# EAGLE design Bitcrusher (EAGLE 8.5.2)
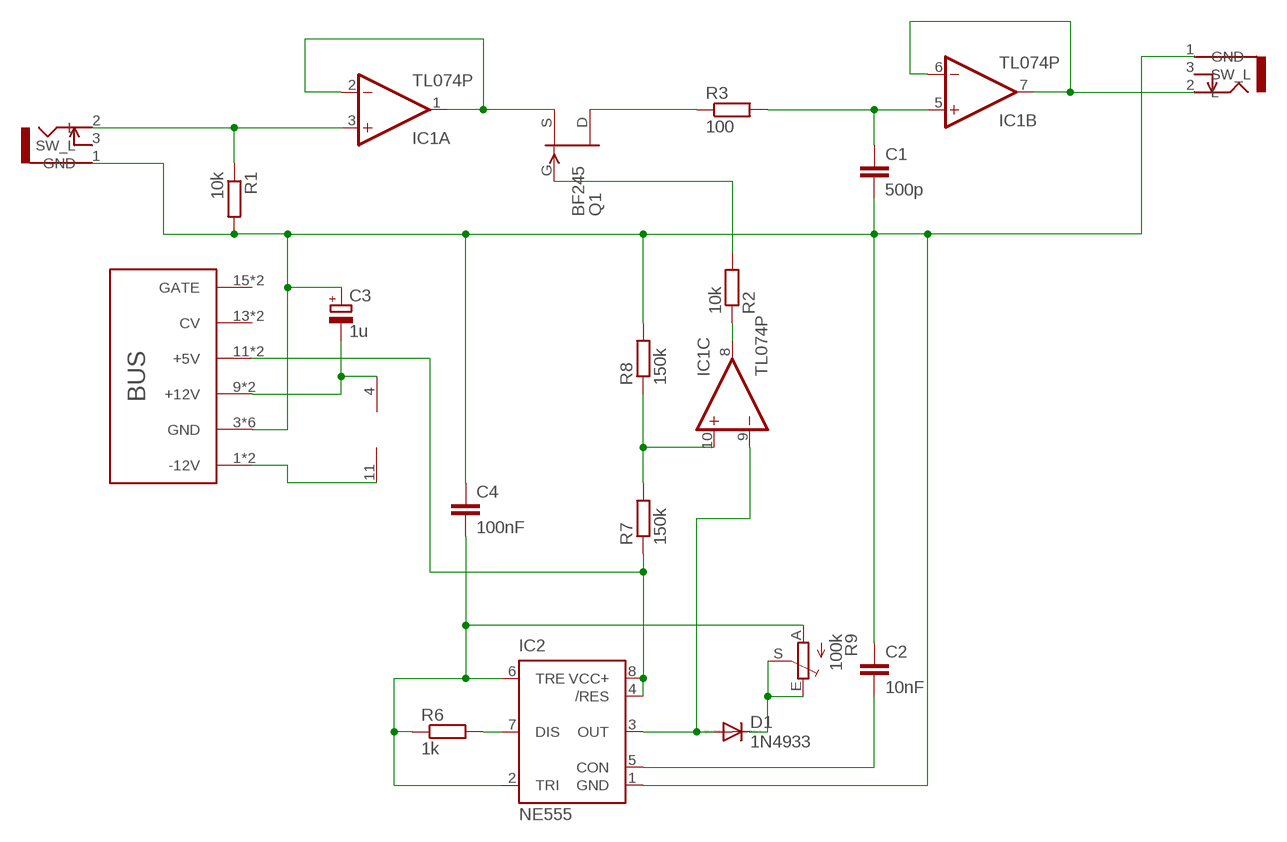
[diagram p0: schematic, sheet 1]

## Parts
C1  500p  C-EU050-024X044  [C050-024X044]
C2  10nF  C-EU050-024X044  [C050-024X044]
C3  1u  CPOL-EUE5-4  [E5-4]
C4  100nF  C-EU050-024X044  [C050-024X044]
D1  1N4933  [DO41-10]
IC1  TL074P  [DIL14]
IC2  NE555  [DIL-08]
Q1  BF245  [TO92]
R1  10k  R-EU_0309/12  [0309/12]
R2  10k  R-EU_0309/12  [0309/12]
R3  100  R-EU_0309/12  [0309/12]
R6  1k  R-EU_0309/12  [0309/12]
R7  150k  R-EU_0309/12  [0309/12]
R8  150k  R-EU_0309/12  [0309/12]
R9  100k  TRIM_EU-CIP20C-6MM  [CIP20C-6MM]
SOUND_INPUT  JC-128-MONO  [JC128]
SOUND_OUTPUT  JC-128-MONO  [JC128]
U$1  EURO16EURO_HALF  [EURO_HALF]

## Nets
N$1: IC1.1(A:OUT) IC1.2(A:-IN) Q1.2(S)
N$2: IC1.3(A:+IN) R1.1 SOUND_INPUT.2(L)
N$3: IC2.7(DIS) R6.2
N$4: IC1.6(B:-IN) IC1.7(B:OUT) SOUND_OUTPUT.2(L)
N$5: C1.1 IC1.5(B:+IN) R3.2
N$6: Q1.1(D) R3.1
N$7: Q1.3(G) R2.2
N$8: C3.- IC1.4(P:V+) U$1.9(+12V) U$1.10(+12V)
N$9: IC1.11(P:V-) U$1.1(-12V) U$1.2(-12V)
N$10: C1.2 C2.1 C3.+ C4.1 IC2.1(GND) R1.2 R8.2 SOUND_INPUT.1(GND) SOUND_OUTPUT.1(GND) U$1.3(GND) U$1.4(GND) U$1.5(GND) U$1.6(GND) U$1.7(GND) U$1.8(GND)
N$11: C2.2 IC2.5(CON)
N$12: IC1.10(C:+IN) R7.2 R8.1
N$13: IC2.4(/RES) IC2.8(VCC+) R7.1 U$1.11(+5V) U$1.12(+5V)
N$14: D1.A IC1.9(C:-IN) IC2.3(OUT)
N$15: IC1.8(C:OUT) R2.1
N$16: C4.2 IC2.2(TRI) IC2.6(TRE) R6.1 R9.A
N$18: D1.C R9.E R9.S
Unconnected: IC1.12(D:+IN) IC1.13(D:-IN) IC1.14(D:OUT) SOUND_INPUT.3(SW_L) SOUND_OUTPUT.3(SW_L) U$1.13(CV) U$1.14(CV) U$1.15(GATE) U$1.16(GATE)

## Library data of the parts
C1 C2 C4 = rcl:C-EU: CAPACITOR, European symbol; SPICEPREFIX: C
C3 = rcl:CPOL-EU: POLARIZED CAPACITOR, European symbol; SPICEPREFIX: C
D1 = diode:1N4933: DIODE fast recovery rectifier, 1A
IC1 = linear:TL074: OP AMP
IC2 = st-microelectronics:NE555: General purpose bipolar Timer; MF: Arrow Electronics; MPN: NE555N; OC_FARNELL: 1467742; OC_NEWARK: 89K1486
Q1 = transistor-fet:BF245: N-Channel Junction FET http://www.onsemi.com/pub/Collateral/BF245A-D.PDF
R1-R3 R7 R8 = rcl:R-EU_: RESISTOR, European symbol; SPICEPREFIX: R
R6 = resistor:R-EU_: RESISTOR, European symbol
R9 = pot:TRIM_EU-: POTENTIOMETER
SOUND_INPUT SOUND_OUTPUT = Klinke:JC-128-MONO
U$1 = 19_inch_synth:EURO16: Busverbindung für 16 Pin Döpfer A-100 Synthesizer

## Board
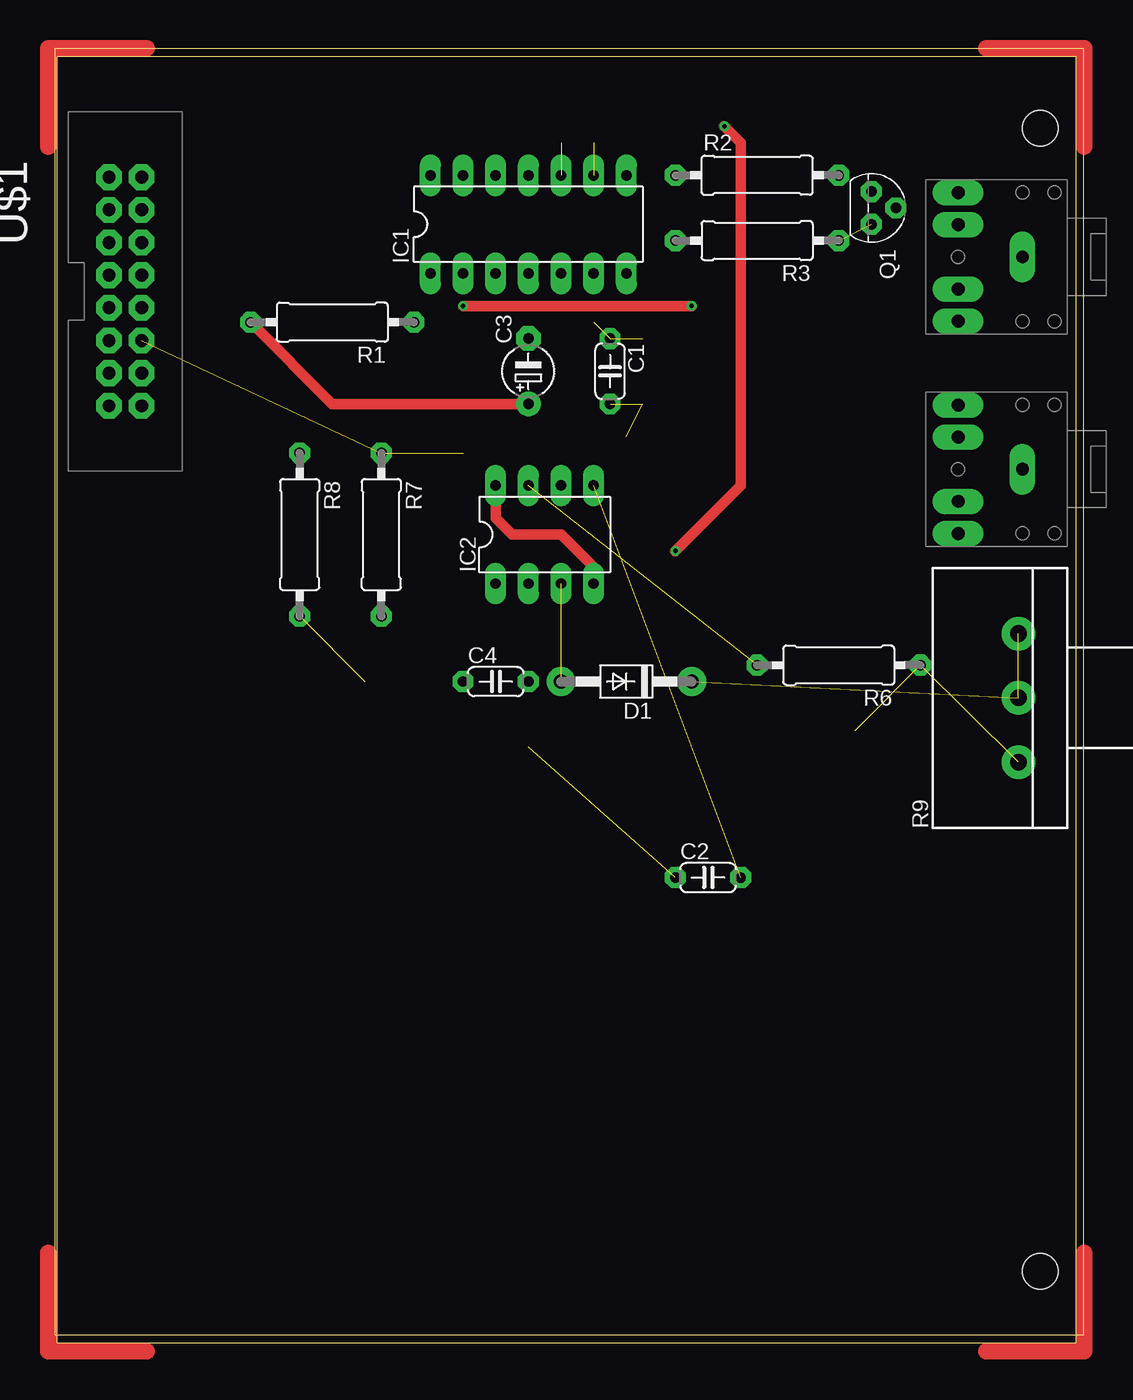
[diagram p1: board, top side]
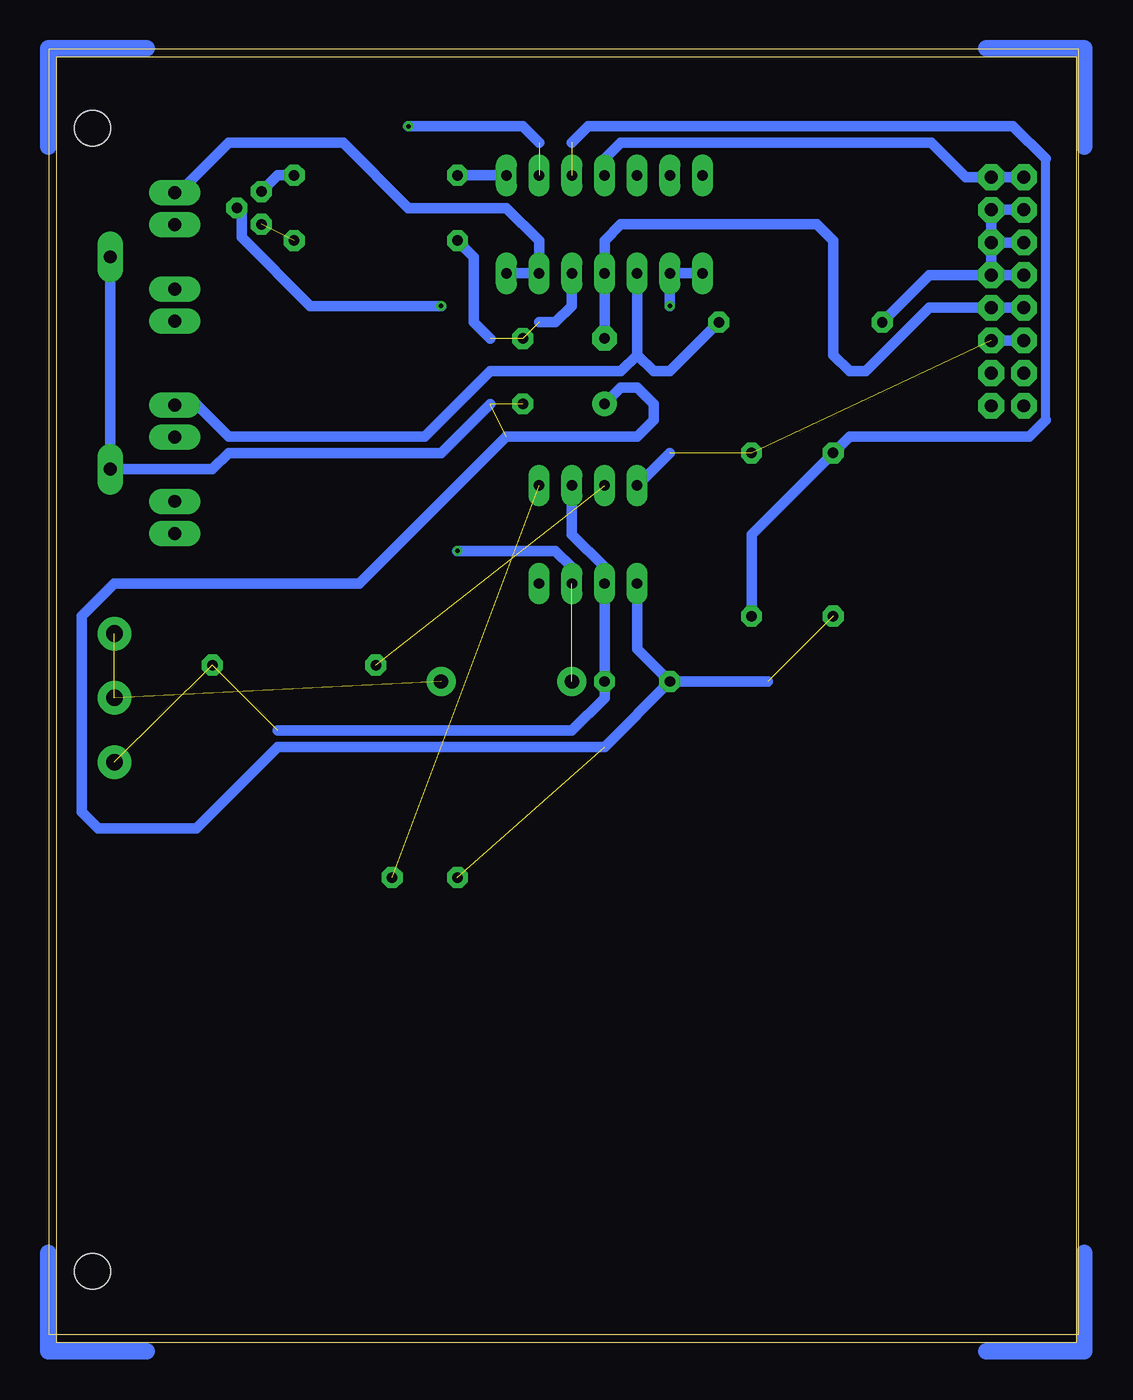
[diagram p2: board, bottom side, seen from below]

Size 80 x 100 mm. Coordinates in mm from the lower left corner, seen from the top.
Outline: 80,0 80,100 0,100 0,0 80,0
Copper layers (1*16): Top 0.035mm / dielectric 1.5mm / Bottom 0.035mm
Design rules "Projektlabor_DRC": minimum track width 24mil, minimum drill 24mil, track to track 16mil, track to pad 12mil, pad to pad 16mil, via to via 24mil, smd to smd 8mil, copper to edge 40mil, drill to drill 8mil, minimum pad ring 10mil, minimum via ring 8mil, stop-mask expansion 4mil, vias tented up to drill 0mil, thermal gap 15mil

### Footprints (pad centres in the part's own frame; a part is rotated, then mirrored left to right if it is on the bottom)
C050-024X044 = drill 0.813 octagon: 1 -2.54,0; 2 2.54,0
E5-4 = drill 0.813 pad 1.905: + -2.54,0 | drill 0.813 pad 1.905 octagon: - 2.54,0
DO41-10 = drill 1.118: A 5.08,0; C -5.08,0
DIL14 = drill 0.813 long: 1 -7.62,-3.81; 2 -5.08,-3.81; 3 -2.54,-3.81; 4 0,-3.81; 5 2.54,-3.81; 6 5.08,-3.81; 7 7.62,-3.81; 8 7.62,3.81; 9 5.08,3.81; 10 2.54,3.81; 11 0,3.81; 12 -2.54,3.81; 13 -5.08,3.81; 14 -7.62,3.81
DIL-08 = drill 0.813 long: 1 -3.81,-3.81; 2 -1.27,-3.81; 3 1.27,-3.81; 4 3.81,-3.81; 5 3.81,3.81; 6 1.27,3.81; 7 -1.27,3.81; 8 -3.81,3.81
TO92 = drill 0.813 octagon: 1 1.27,0; 2 0,1.905; 3 -1.27,0
0309/12 = drill 0.813 octagon: 1 -6.35,0; 2 6.35,0
CIP20C-6MM = drill 1.3 pad 1.93: A -5,0; E 5,0; S 0,0
JC128 = drill 1 pad 1.7 long: 1 3.5,0; 2 8.5,-5; 3 8.5,-2.5; 4 8.5,2.5; 5 8.5,5
EURO_HALF = drill 1 octagon: 1 75.785,-40.492; 2 73.245,-40.492; 3 75.785,-37.953; 4 73.245,-37.953; 5 75.785,-35.413; 6 73.245,-35.413; 7 75.785,-32.873; 8 73.245,-32.873; 9 75.785,-30.332; 10 73.245,-30.332; 11 75.785,-27.793; 12 73.245,-27.793; 13 75.785,-25.253; 14 73.245,-25.253; 15 75.785,-22.712; 16 73.245,-22.712 | hole 2.794: 3.385,-44.303; 3.385,44.597

### Placement (x,y rotation side)
C1  43.17,74.93 270 top
C2  50.79,35.56 0 top
C3  36.82,74.93 90 top
C4  34.28,50.8 0 top
D1  44.44,50.8 180 top
IC1  36.82,86.36 0 top
IC2  38.09,62.23 0 top
Q1  63.49,87.63 270 top
R1  21.58,78.74 180 top
R2  54.6,90.17 0 top
R3  54.6,85.09 180 top
R6  60.95,52.07 180 top
R7  25.39,62.23 270 top
R8  19.04,62.23 270 top
R9  74.92,49.53 90 top
SOUND_INPUT  78.73,67.31 180 top
SOUND_OUTPUT  78.73,83.82 180 top
U$1  80,49.53 180 top

### Tracks (layer width: path | path; a pad name or v marks a point on that pad's centre or on a via)
N$1  (via drill 0.35)
  Top 0.8: v31.74,80.01 v49.52,80.01
  Bottom 0.8: IC1.1 IC1.2 v31.74,80.01 | v49.52,80.01 59.68,80.01 65.01,85.34 65.01,87.24 Q1.2
N$2
  Bottom 0.8: 34.28,76.2 35.55,74.93 45.71,74.93 50.79,69.85 66.03,69.85 68.57,72.39 SOUND_INPUT.2 | R1.1 31.74,74.93 33.01,74.93 34.28,76.2 | 34.28,76.2 IC1.3
N$3  (1 unrouted)
N$4
  Bottom 0.8: IC1.7 IC1.6 41.9,85.09 44.44,87.63 52.06,87.63 57.14,92.71 66.03,92.71 69.84,88.9 SOUND_OUTPUT.2
N$5  (2 unrouted)
  Bottom 0.8: IC1.5 39.36,80.01 40.63,78.74 41.9,78.74 | R3.2 46.98,83.82 46.98,78.74 45.71,77.47
N$6  (1 unrouted)
N$7
  Bottom 0.8: R2.2 62.22,90.17 Q1.3
N$8
  Bottom 0.8: U$1.9 U$1.10 11.57,79.86 16.5,74.93 17.77,74.93 19.04,76.2 19.04,85.09 20.31,86.36 33.01,86.36 35.55,86.36 36.82,85.09 IC1.4 C3.-
N$9
  Bottom 0.8: U$1.1 U$1.2 8.73,90.02 11.42,92.71 35.55,92.71 36.82,91.44 IC1.11
N$10  (4 unrouted)
  Top 0.8: R1.2 21.58,72.39 C3.+
  Bottom 0.8: U$1.3 U$1.4 U$1.6 | U$1.5 U$1.6 | U$1.7 U$1.8 | U$1.8 U$1.6 | 45.71,72.39 49.52,68.58 66.03,68.58 67.3,67.31 SOUND_INPUT.1 SOUND_OUTPUT.1 | 24.12,50.8 C4.1 | C4.1 34.28,53.34 IC2.1 | U$1.8 11.57,82.4 R1.2 | C3.+ 35.55,73.66 34.28,73.66 33.01,72.39 33.01,71.12 34.28,69.85 44.44,69.85 55.87,58.42 74.92,58.42 77.46,55.88 77.46,40.64 76.19,39.37 68.57,39.37 62.22,45.72 36.82,45.72 C4.1
N$11  (1 unrouted)
N$12  (1 unrouted)
  Bottom 0.7: 2.53,71.12 2.53,91.44
  Bottom 0.8: R7.2 25.39,62.23 R8.1 17.77,69.85 3.8,69.85 2.53,71.12 | 2.53,91.44 5.07,93.98 38.09,93.98 39.36,92.71
N$13  (2 unrouted)
  Top 0.8: IC2.8 34.28,63.5 35.55,62.23 39.36,62.23 41.9,59.69 IC2.4
  Bottom 0.8: U$1.11 U$1.12 | 31.74,68.58 IC2.8
N$14  (via drill 0.35)  (2 unrouted)
  Top 0.8: v48.25,60.96 53.33,66.04 53.33,92.71 v52.06,93.98
  Bottom 0.8: IC2.3 39.36,59.69 40.63,60.96 v48.25,60.96 | v52.06,93.98 43.17,93.98 41.9,92.71
N$15
  Bottom 0.8: IC1.8 R2.1
N$16  (2 unrouted)
  Bottom 0.8: 62.22,46.99 39.36,46.99 36.82,49.53 C4.2 IC2.2 36.82,59.69 39.36,62.23 IC2.6
N$18  (2 unrouted)